# EAGLE design dc booster (EAGLE 6.2)
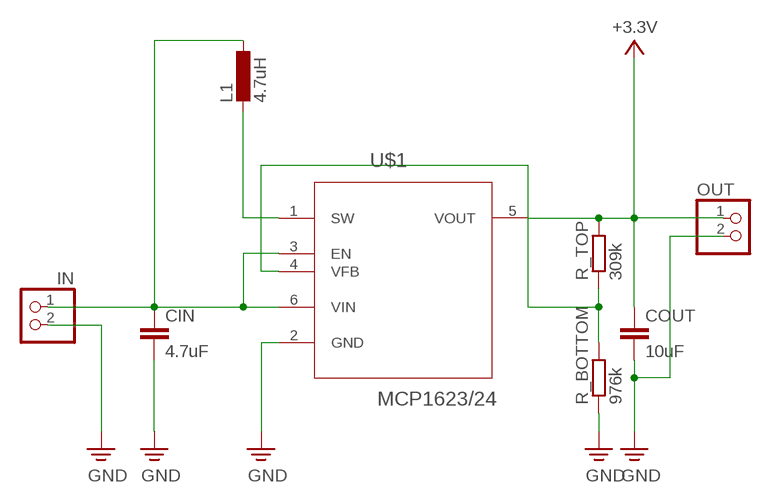
[diagram p0: schematic, sheet 1]

## Parts
CIN  4.7uF  C-EUC0805  [C0805]
COUT  10uF  C-EUC0805  [C0805]
IN  PINHD-1X2  [1X02]
L1  4.7uH  L-EUWE-TPC  [POWER-CHOKE_WE-TPC]
OUT  PINHD-1X2  [1X02]
R_BOTTOM  976k  R-EU_R0805  [R0805]
R_TOP  309k  R-EU_R0805  [R0805]
U$1  MCP1623/24  [SOT95P300X120-6N]

## Nets
N$1: CIN.1 IN.1 L1.1 U$1.3(EN) U$1.6(VIN)
N$2: L1.2 U$1.1(SW)
N$3: R_BOTTOM.2 R_TOP.1 U$1.4(VFB)
PE: CIN.2 COUT.2 IN.2 OUT.2 R_BOTTOM.1 U$1.2(GND) ; supply symbol labelled GND
VCC: COUT.1 OUT.1 R_TOP.2 U$1.5(VOUT) ; supply symbol labelled +3.3V

## Library data of the parts
CIN COUT = rcl:C-EU: CAPACITOR, European symbol
IN OUT = pinhead:PINHD-1X2: PIN HEADER
L1 = rcl:L-EU: INDUCTOR, European symbol
R_BOTTOM R_TOP = rcl:R-EU_: RESISTOR, European symbol
U$1 = MCP1623:MCP1623/24: IC, BOOST, REG, PWM/PFM, SOT-23-6 Primary Input Voltage: 5.5V No. of Outputs: 1 Output Voltage: 5.5V Output Current: 50mA Voltage Regulator Case Style: SOT-23 No. of Pins: 6 Operating Temperature Range: -40°C to +85°C SVHC: No SVHC (18-Jun-2012) Base Number: 1623

## Board
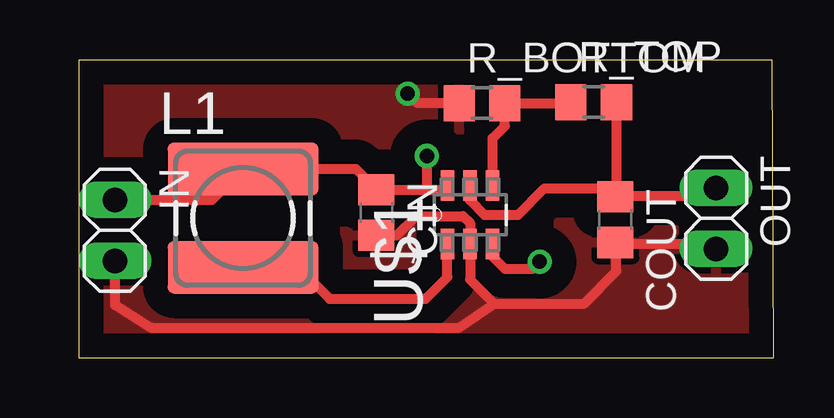
[diagram p1: board, top side]
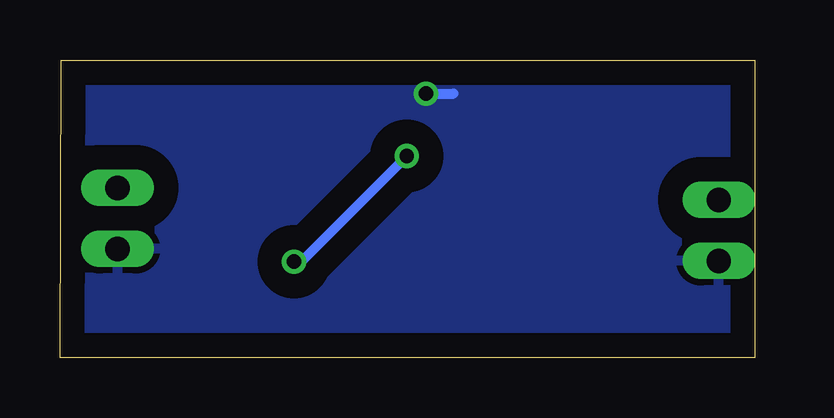
[diagram p2: board, bottom side, seen from below]

Size 28.95 x 12.4 mm. Coordinates in mm from the lower left corner, seen from the top.
Outline: 0,0 28.95,0 28.9,12.4 0,12.4 0,0
Copper layers (1*16): Top 0.035mm / dielectric 1.5mm / Bottom 0.035mm
Design rules: minimum track width 10mil, minimum drill 24mil, track to track 8mil, track to pad 8mil, pad to pad 8mil, via to via 8mil, smd to smd 8mil, copper to edge 40mil, drill to drill 8mil, minimum pad ring 10mil, minimum via ring 8mil, stop-mask expansion 4mil, vias tented up to drill 0mil, thermal gap 10mil

### Footprints (pad centres in the part's own frame; a part is rotated, then mirrored left to right if it is on the bottom)
C0805 = smd 1.3 x 1.5: 1 -0.95,0; 2 0.95,0
1X02 = drill 1.016 long: 1 -1.27,0; 2 1.27,0
POWER-CHOKE_WE-TPC = smd 6.3 x 2.2: 1 0,2.05; 2 0,-2.05
R0805 = smd 1.3 x 1.5: 1 -0.95,0; 2 0.95,0
SOT95P300X120-6N = smd 1.27 x 0.559: 1 -1.219,0.94; 2 -1.219,0; 3 -1.219,-0.94; 4 1.219,-0.94; 5 1.219,0; 6 1.219,0.94

### Placement (x,y rotation side)
CIN  12.4,6.05 270 top
COUT  22.35,5.75 270 top
IN  1.5,5.3 270 top
L1  6.84,5.81 0 top
OUT  26.55,5.8 270 top
R_BOTTOM  16.8,10.6 0 top
R_TOP  21.45,10.65 0 top
U$1  16.3,5.95 90 top

### Tracks (layer width: path | path; a pad name or v marks a point on that pad's centre or on a via)
N$1  (via drill 0.6)
  Top 0.406: 14.55,7 CIN.1 11.54,7.86 L1.1 5.55,6.57 IN.1 | 14.55,7 15.19,7 U$1.6 | U$1.3 17.24,4.21 17.75,3.7 18.9,3.7 v19.2,4 | v14.5,8.4 14.5,7.05 14.55,7
  Bottom 0.406: v19.2,4 18.9,4 v14.5,8.4
N$2
  Top 0.406: L1.2 9.14,3.76 10.45,2.45 14.45,2.45 15.35,3.35 U$1.1
N$3
  Top 0.406: U$1.4 17.24,9.14 17.75,9.65 R_BOTTOM.2 20.45,10.6 R_TOP.1
PE  (via drill 0.6)
  Top 0.406: CIN.2 13.25,5.1 14.05,5.9 16,5.9 16.3,5.6 U$1.2 16.3,3.25 17.3,2.25 | 17.3,2.25 21.05,2.25 22.4,3.6 22.4,4.75 | 22.4,4.75 COUT.2 | IN.2 1.5,2.2 3,1.25 15.85,1.25 17.3,2.25 | 22.4,4.75 26.33,4.75 OUT.2 | R_BOTTOM.1 14.1,10.6 v13.7,11
  Bottom 0.406: v13.7,11 12.55,11
  pour Top (isolate 1.016): -0.05,12.5 29.05,12.5 29.05,0 -0.05,0
  pour Bottom (isolate 1.016): 0.05,12.4 29.05,12.4 29.05,0.1 0.05,0.1
VCC
  Top 0.406: U$1.5 16.3,6.55 16.9,5.95 18.3,5.95 19.4,7.05 22,7.05 COUT.1 22.4,6.75 | R_TOP.2 22.4,6.75 | 22.4,6.75 26.23,6.75 OUT.1